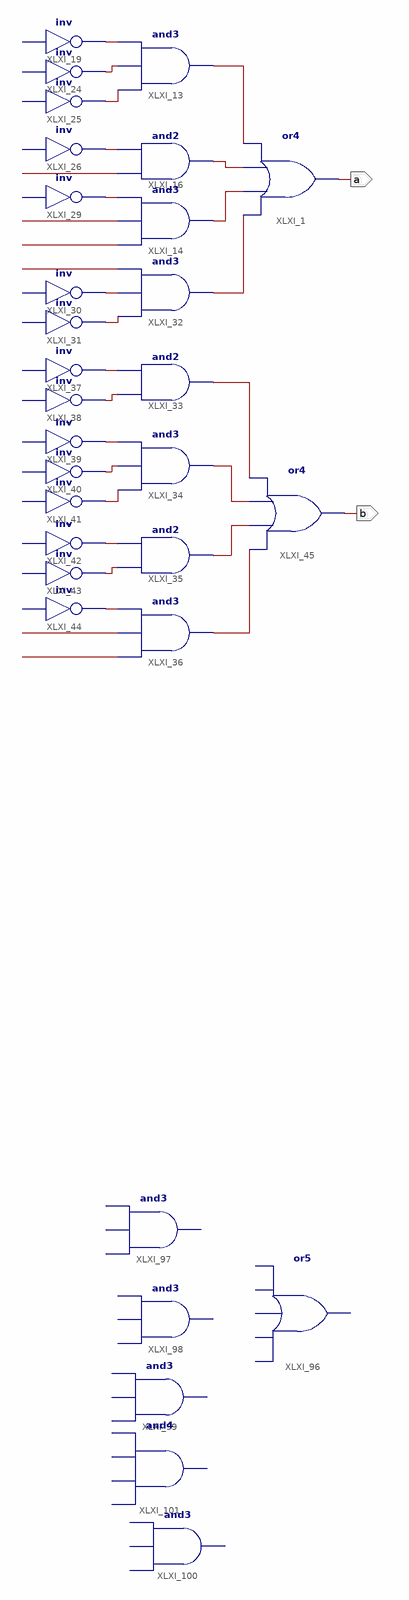
[diagram p0: schematic sheet 1]
// Xilinx ISE schematic Counter1_6.sch (spartan6) as structural Verilog: 31 symbols, 2 ports
module Counter1_6 (
  output a,
  output b
);

  wire XLXN_1, XLXN_2, XLXN_3, XLXN_4, XLXN_5, XLXN_6, XLXN_8, XLXN_9, XLXN_10, XLXN_11, XLXN_12, XLXN_13,
       XLXN_14, XLXN_15, XLXN_16, XLXN_18, XLXN_19, XLXN_20, XLXN_21, XLXN_22, XLXN_23, XLXN_24, XLXN_25,
       XLXN_26, XLXN_27, XLXN_28, XLXN_29, XLXN_30, XLXN_31;

  and XLXI_13 (XLXN_13, XLXN_3, XLXN_2, XLXN_1);
  // inv XLXI_19 has open pins: I=open, O=XLXN_1
  // inv XLXI_24 has open pins: I=open, O=XLXN_2
  // inv XLXI_25 has open pins: I=open, O=XLXN_3
  // inv XLXI_26 has open pins: I=open, O=XLXN_4
  and XLXI_16 (XLXN_14, XLXN_5, XLXN_4);
  and XLXI_14 (XLXN_15, XLXN_9, XLXN_6, XLXN_8);
  // inv XLXI_29 has open pins: I=open, O=XLXN_8
  and XLXI_32 (XLXN_16, XLXN_11, XLXN_10, XLXN_12);
  // inv XLXI_30 has open pins: I=open, O=XLXN_10
  // inv XLXI_31 has open pins: I=open, O=XLXN_11
  or XLXI_1 (a, XLXN_16, XLXN_15, XLXN_14, XLXN_13);
  and XLXI_35 (XLXN_30, XLXN_24, XLXN_23);
  // inv XLXI_44 has open pins: I=open, O=XLXN_25
  or XLXI_45 (b, XLXN_31, XLXN_30, XLXN_29, XLXN_28);
  // inv XLXI_37 has open pins: I=open, O=XLXN_18
  // inv XLXI_38 has open pins: I=open, O=XLXN_19
  // inv XLXI_39 has open pins: I=open, O=XLXN_20
  // inv XLXI_40 has open pins: I=open, O=XLXN_21
  // inv XLXI_41 has open pins: I=open, O=XLXN_22
  and XLXI_33 (XLXN_28, XLXN_19, XLXN_18);
  and XLXI_34 (XLXN_29, XLXN_22, XLXN_21, XLXN_20);
  // inv XLXI_43 has open pins: I=open, O=XLXN_24
  // inv XLXI_42 has open pins: I=open, O=XLXN_23
  and XLXI_36 (XLXN_31, XLXN_27, XLXN_26, XLXN_25);
  // or5 XLXI_96 is placed but not wired
  // and3 XLXI_97 is placed but not wired
  // and3 XLXI_98 is placed but not wired
  // and3 XLXI_99 is placed but not wired
  // and3 XLXI_100 is placed but not wired
  // and4 XLXI_101 is placed but not wired
endmodule
